# EAGLE schematic eprom_reader (EAGLE 6.5.0)
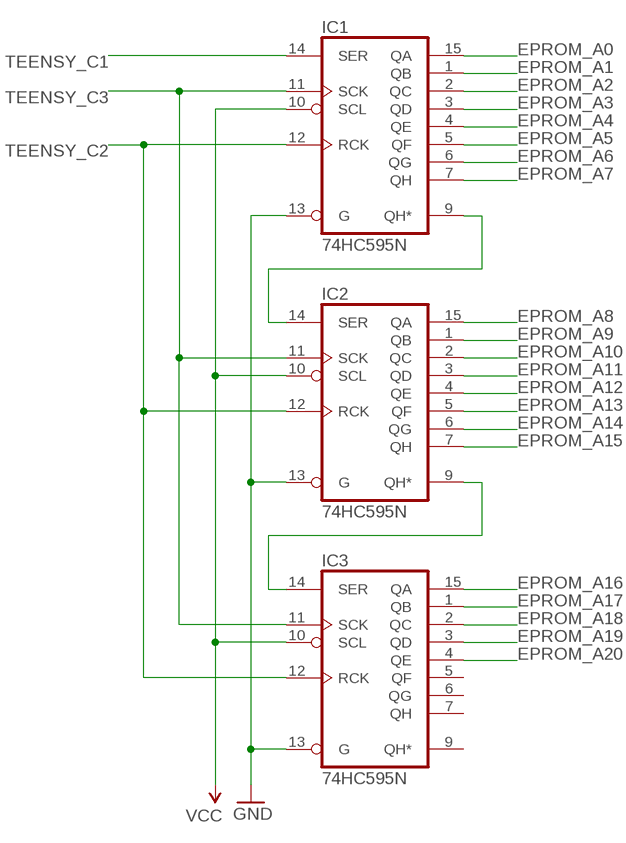
[diagram p0: schematic, sheet 1]

## Parts
IC1  74HC595N  [DIL16]
IC2  74HC595N  [DIL16]
IC3  74HC595N  [DIL16]

## Nets
EPROM_A0: IC1.15(QA)
EPROM_A1: IC1.1(QB)
EPROM_A2: IC1.2(QC)
EPROM_A3: IC1.3(QD)
EPROM_A4: IC1.4(QE)
EPROM_A5: IC1.5(QF)
EPROM_A6: IC1.6(QG)
EPROM_A7: IC1.7(QH)
EPROM_A8: IC2.15(QA)
EPROM_A9: IC2.1(QB)
EPROM_A10: IC2.2(QC)
EPROM_A11: IC2.3(QD)
EPROM_A12: IC2.4(QE)
EPROM_A13: IC2.5(QF)
EPROM_A14: IC2.6(QG)
EPROM_A15: IC2.7(QH)
EPROM_A16: IC3.15(QA)
EPROM_A17: IC3.1(QB)
EPROM_A18: IC3.2(QC)
EPROM_A19: IC3.3(QD)
EPROM_A20: IC3.4(QE)
GND: IC1.13(G) IC2.13(G) IC3.13(G)
N$1: IC1.9(QH*) IC2.14(SER)
N$2: IC2.9(QH*) IC3.14(SER)
TEENSY_C1: IC1.14(SER)
TEENSY_C2: IC1.12(RCK) IC2.12(RCK) IC3.12(RCK)
TEENSY_C3: IC1.11(SCK) IC2.11(SCK) IC3.11(SCK)
VCC: IC1.10(SCL) IC2.10(SCL) IC3.10(SCL)
Unconnected: IC3.5(QF) IC3.6(QG) IC3.7(QH) IC3.9(QH*)

## Power pins joined to a net without a drawn wire
GND: IC1.8(GND) IC2.8(GND) IC3.8(GND)
VCC: IC1.16(VCC) IC2.16(VCC) IC3.16(VCC)

## Library data of the parts
IC1-IC3 = 74xx-eu:74*595: 8-bit SHIFT REGISTER, output latch